# Altium schematic sheet MagneticEncorder.SchDoc
size A4
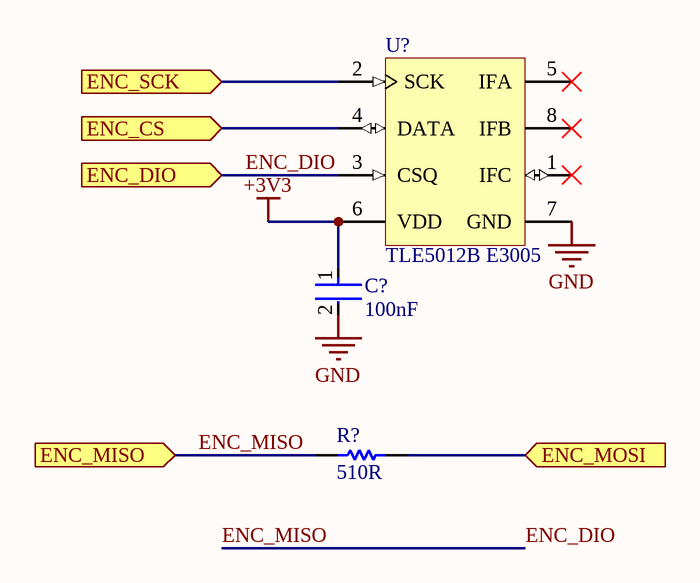
[diagram p0: MagneticEncorder.SchDoc]

## Parts
C?  Capacitance: 100nF  [FP-1206-L_3_2_0_2-W_1_6_0-MFG]  (hidden comment: 12061C104KAZ2A)
R?  Resistance: 510R  [RESC1608X55X30NL15T15]  (hidden comment: ERJ3EKF5100V)
U?  TLE5012B E3005  [INF-PG-DSO-8-16_N]

## Ports
ENC_CS (in), ENC_DIO (in), ENC_MISO (in), ENC_MOSI (in), ENC_SCK (in)

## Nets
+3V3: C?.1 U?.6(VDD)
GND: C?.2 U?.7(GND)
ENC_CS: U?.4(DATA) ; port ENC_CS
ENC_DIO: R?.1 U?.3(CSQ) ; port ENC_DIO, port ENC_MISO  [also labelled ENC_MISO]
ENC_MOSI: R?.2 ; port ENC_MOSI
ENC_SCK: U?.2(SCK) ; port ENC_SCK

Not connected (* = marked no-connect by the designer): U? 1(IFC)* 5(IFA)* 8(IFB)*

## Library data of the parts
C? = CMP-04427-004798-1: General Purpose Ceramic Capacitor, 1206, 100nF, 10%, X7R, 15%, 100V; Features: Soft Termination; Termination: SMD/SMT; Mount: Surface Mount; Tolerance: 10%; Voltage Rating: 100V; Length: 3.2mm; Case/Package: 1206; Case Code (Metric): 3216; RoHS Compliant: Yes; Package Quantity: 1; Max Operating Temperature: 125°C; Voltage Rating (DC): 100V; Min Operating Temperature: -55°C; Number of Pins: 2; Packaging: Tape and Reel; Width: 0.063inch; REACH SVHC: No SVHC; Lead Free: Lead Free; Construction: Flat; Radiation Hardening: No; Case Code (Imperial): 1206; Thickness: 0.05inch; Series: FLEXITERM®; Depth: 1.6mm; Dielectric: X7R
R? = CMP-2000-00539-1: Manufacturer: Panasonic; Part Number: ERJ3EKF5100V
U? = CMP-1135-00008-1: GMR-Based Angle Sensor, PG-DSO-8-16, Reel, Green; Manufacturer: Infineon; Green: TRUE; Interface: SPI, HSM; ComponentLink3Description: Package Specification; PartNumber: TLE5012B E3005; PackageReference: PG-DSO-8-16; ComponentLink3URL: http://www.infineon.com/dgdl/TLE7259-2GE_DS_rev12.pdf?folderId=db3a3043163797a6011666d32a0c0de1&fileId=db3a3043163797a6011666d4dbb80de2&location=en.Products.Automotive_ICs.Automotive_Transceivers.LIN_Transceivers.DATASHEET.TLE7259-2GE_DS_rev12.pdf; Halogen-free: available; Packing: Reel; PackageVersion: Mar-07; PackageDescription: 8-Pin Plastic (Green) Dual Small Outline Package, 4.9 x 3.9 mm Body, 1.27 mm Pitch; ComponentLink2URL: http://www.infineon.com/dgdl/TLE5012B_FDS_Rev1+1.pdf?folderId=db3a30431ce5fb52011d3dd6e8012582&fileId=db3a304334fac4c601350f31c43c433f; ComponentLink2Description: Datasheet; ComponentLink1Description: Manufacturer URL; DatasheetVersion: Rev. 1.1; ComponentLink1URL: http://www.infineon.com/; Mounting Technology: Surface Mount